# EAGLE design Scart (EAGLE 7.3.0)
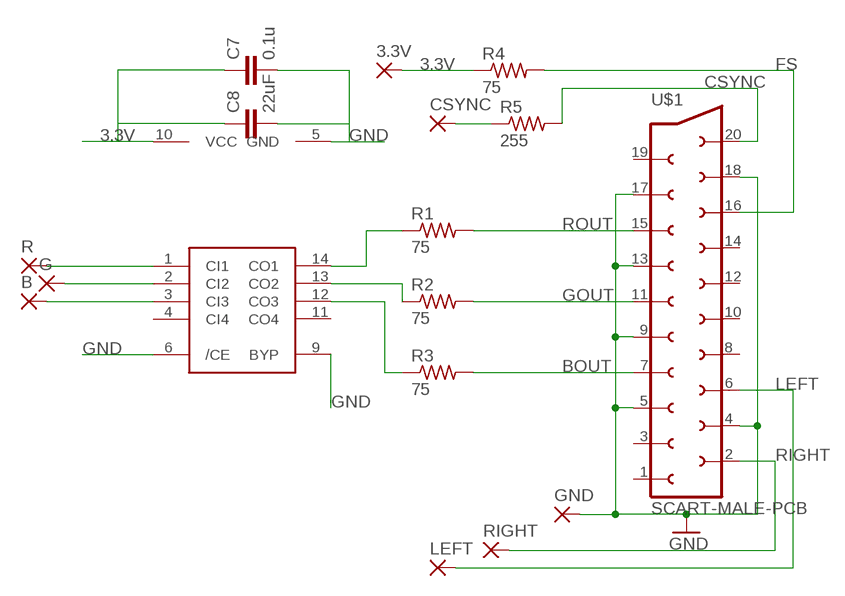
[diagram p0: schematic, sheet 1]

## Parts
3.3V  WIREPADSMD1,27-254  [SMD1,27-2,54]
B  WIREPADSMD1,27-254  [SMD1,27-2,54]
C7  0.1u  C-EUC0805K  [C0805K]
C8  22uF  C-EUC0805K  [C0805K]
CSYNC  WIREPADSMD1,27-254  [SMD1,27-2,54]
G  WIREPADSMD1,27-254  [SMD1,27-2,54]
GND  WIREPADSMD1,27-254  [SMD1,27-2,54]
LEFT  WIREPADSMD1,27-254  [SMD1,27-2,54]
R  WIREPADSMD1,27-254  [SMD1,27-2,54]
R1  75  R-US_R0805  [R0805]
R2  75  R-US_R0805  [R0805]
R3  75  R-US_R0805  [R0805]
R4  75  R-US_R0805  [R0805]
R5  255  R-US_R0805  [R0805]
RIGHT  WIREPADSMD1,27-254  [SMD1,27-2,54]
U$1  SCART-MALE-PCB  [SCART-PCB]
U$2  THS7374  [THS7374]

## Nets
3.3V: 3.3V.1(P) C7.1 C8.1 R4.1 U$2.10(VCC)
BOUT: R3.2 U$1.7
CSYNC: R5.2 U$1.20
FS: R4.2 U$1.16
GND: C7.2 C8.2 GND.1(P) U$1.4 U$1.5 U$1.9 U$1.13 U$1.17 U$1.18 U$2.5(GND) U$2.6(/CE) U$2.9(BYP)
GOUT: R2.2 U$1.11
LEFT: LEFT.1(P) U$1.6
N$4: R.1(P) U$2.1(CI1)
N$8: R1.1 U$2.14(CO1)
N$9: R2.1 U$2.13(CO2)
N$11: R3.1 U$2.12(CO3)
N$14: G.1(P) U$2.2(CI2)
N$16: B.1(P) U$2.3(CI3)
N$17: CSYNC.1(P) R5.1
RIGHT: RIGHT.1(P) U$1.2
ROUT: R1.2 U$1.15
Unconnected: U$1.1 U$1.3 U$1.8 U$1.10 U$1.12 U$1.14 U$1.19 U$2.4(CI4) U$2.11(CO4)

## Library data of the parts
3.3V B CSYNC G GND LEFT R RIGHT = wirepad:WIREPAD: Wire PAD connect wire on PCB
C7 C8 = rcl:C-EU: CAPACITOR, European symbol
R1-R5 = rcl:R-US_: RESISTOR, American symbol
U$1 = con-hirschmann:SCART-MALE-PCB
U$2 = snes_div:THS7374

## Board
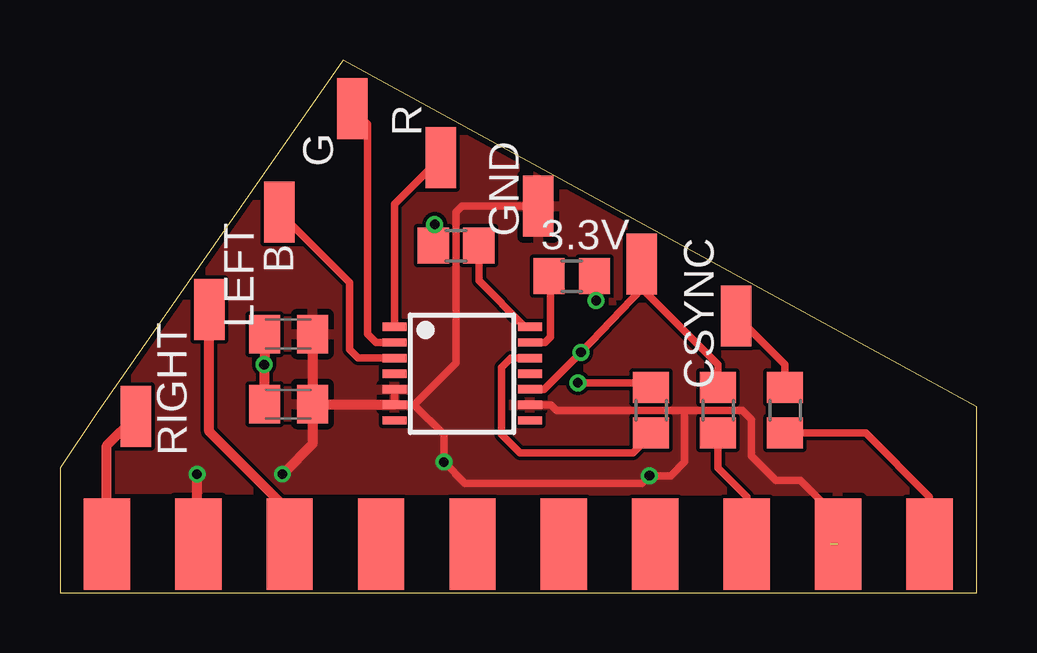
[diagram p1: board, top side]
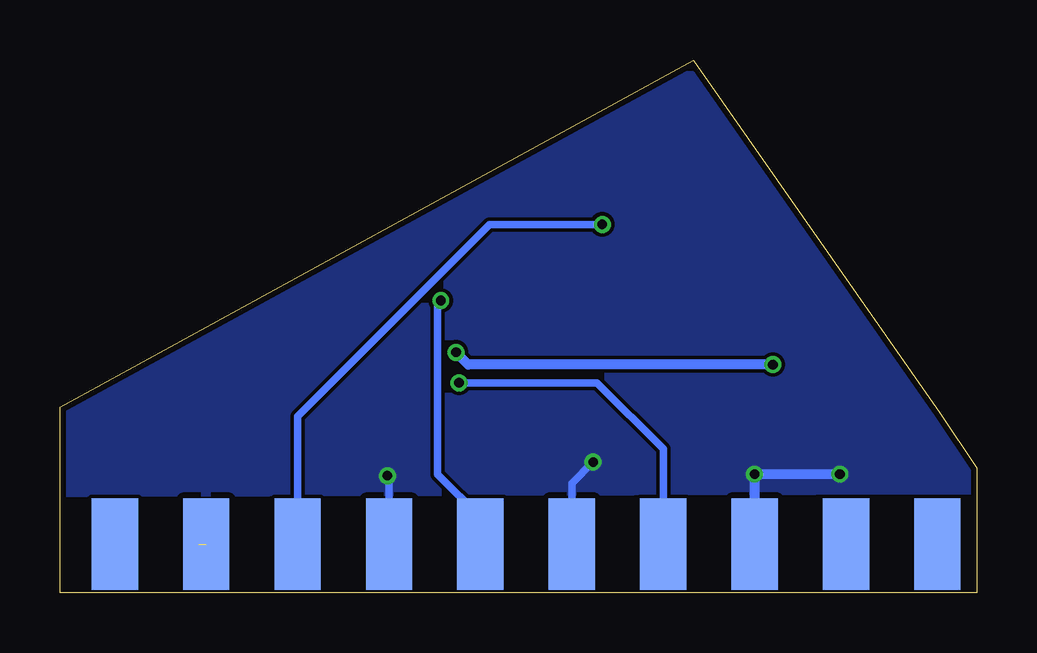
[diagram p2: board, bottom side, seen from below]

Size 38.23 x 22.23 mm. Coordinates in mm from the lower left corner, seen from the top.
Outline: 11.81,22.23 1.52,7.49 0,5.21 0,0 38.23,0 38.23,7.75 11.81,22.23
Copper layers (1*16): Top 0.035mm / dielectric 1.5mm / Bottom 0.035mm
Design rules "seedstudio_Fusion_eagle_rule_v1.1": minimum track width 6mil, minimum drill 12mil, track to track 6mil, track to pad 6mil, pad to pad 6mil, via to via 6mil, smd to smd 0mil, copper to edge 10mil, drill to drill 10mil, minimum pad ring 10mil, minimum via ring 6mil, stop-mask expansion 2mil, vias tented up to drill 100mil, thermal gap 10mil

### Footprints (pad centres in the part's own frame; a part is rotated, then mirrored left to right if it is on the bottom)
SMD1,27-2,54 = smd 1.27 x 2.54: 1 0,0
C0805K = smd 1.3 x 1.6: 1 -1,0; 2 1,0
R0805 = smd 1.3 x 1.5: 1 -0.95,0; 2 0.95,0
SCART-PCB = smd 1.93 x 3.81: 1 16.51,0; 3 12.7,0; 5 8.89,0; 7 5.08,0; 9 1.27,0; 11 -2.54,0; 13 -6.35,0; 15 -10.16,0; 17 -13.97,0; 19 -17.78,0 | smd 1.93 x 3.81 bottom: 2 16.205,0; 4 12.395,0; 6 8.585,0; 8 4.775,0; 10 0.965,0; 12 -2.845,0; 14 -6.655,0; 16 -10.465,0; 18 -14.275,0; 20 -18.085,0
THS7374 = smd 0.35 x 1: 1 -1.95,-2.825; 2 -1.3,-2.825; 3 -0.65,-2.825; 4 0,-2.825; 5 0.65,-2.825; 6 1.3,-2.825; 7 1.95,-2.825; 8 1.95,2.825; 9 1.3,2.825; 10 0.65,2.825; 11 0,2.825; 12 -0.65,2.825; 13 -1.3,2.825; 14 -1.95,2.825

### Placement (x,y rotation side)
3.3V  24.26,13.72 0 top
B  9.14,15.88 0 top
C7  9.53,10.79 0 top
C8  9.53,7.87 0 top
CSYNC  28.19,11.56 0 top
G  12.19,20.19 0 top
GND  19.94,16.13 0 top
LEFT  6.22,11.81 0 top
R  15.88,18.16 0 top
R1  16.51,14.48 180 top
R2  21.34,13.21 0 top
R3  24.64,7.62 90 top
R4  27.43,7.62 270 top
R5  30.23,7.62 270 top
RIGHT  3.18,7.37 0 top
U$1  18.16,2.03 0 bottom
U$2  16.76,9.14 270 top

### Tracks (layer width: path | path; a pad name or v marks a point on that pad's centre or on a via)
3.3V  (via drill 0.4)
  Top 0.305: 3.3V.1 24.26,12.7 | 24.26,12.7 v21.72,10.03 20.18,8.49 U$2.10 | R4.1 27.43,9.53 24.26,12.7
  Top 0.406: C7.1 8.53,9.54 v8.51,9.53 8.53,9.51 C8.1
  Bottom 0.406: v8.51,9.53 21.21,9.53 v21.72,10.03
BOUT  (via drill 0.4)
  Top 0.305: v21.59,8.76 24.45,8.76 R3.2
  Bottom 0.305: U$1.7 13.08,6 15.84,8.76 v21.59,8.76
CSYNC
  Top 0.305: U$1.20 36.25,4.01 33.59,6.67 R5.2
FS
  Top 0.305: R4.2 27.43,5.21 28.63,4.01 U$1.16
GND  (via drill 0.4)  (1 unrouted)
  Top 0.305: U$2.5 U$2.6 14.76,7.84 | v24.57,4.89 24.26,4.57 16.89,4.57 v16,5.46 16,6.6 14.76,7.84 | v24.57,4.89 24.64,4.95 | U$1.18 32.44,3.12 30.86,4.7 29.84,4.7 28.83,5.71 28.83,7.24 28.45,7.62 26.04,7.62 | 26.04,7.62 20.7,7.62 20.48,7.84 U$2.9 | v24.57,4.89 25.46,4.89 26.04,5.46 26.04,7.62 | GND.1 16.76,16.13 16.51,15.88 16.51,9.59 14.76,7.84
  Top 0.406: U$1.4 5.71,2.03 v5.71,4.95 | U$2.6 10.55,7.84 C8.2 | C7.2 C8.2 | C8.2 10.53,6.21 v9.27,4.95
  Bottom 0.305: U$1.13 24.51,4.83 v24.57,4.89 | U$1.9 16.89,4.57 v16,5.46
  Bottom 0.406: v5.71,4.95 v9.27,4.95 9.27,4.57 U$1.5
  pour Top: 11.94,22.48 44.7,4.19 -0.89,4.32
  pour Bottom: 11.94,22.48 44.7,4.19 -0.89,4.32
GOUT  (via drill 0.4)
  Top 0.305: v22.35,12.19 22.35,13.14 R2.2
  Bottom 0.305: U$1.11 20.7,3.17 22.48,4.95 22.48,12.06 v22.35,12.19
LEFT
  Top 0.406: U$1.6 9.58,3.38 6.22,6.73 LEFT.1
N$4
  Top 0.305: U$2.1 13.94,16.23 R.1
N$8
  Top 0.305: U$2.14 19.39,11.09 17.46,13.02 R1.1
N$9
  Top 0.305: U$2.13 20.22,10.44 20.45,10.67 20.45,13.15 R2.1
N$11
  Top 0.305: R3.1 24.64,6.6 23.88,5.84 19.18,5.84 18.41,6.6 18.41,9.4 18.81,9.79 U$2.12
N$14
  Top 0.305: U$2.2 13.18,10.44 12.83,10.79 12.83,19.56 G.1
N$16
  Top 0.305: U$2.3 12.43,9.79 12.07,10.16 12.07,12.95 B.1
N$17
  Top 0.305: R5.1 30.23,9.53 CSYNC.1
RIGHT
  Top 0.406: U$1.2 1.96,6.15 RIGHT.1
ROUT  (via drill 0.4)
  Top 0.305: v15.62,15.37 15.62,14.54 R1.2
  Bottom 0.305: U$1.15 28.32,7.37 20.32,15.37 v15.62,15.37

### Text on the board
201bmp: C:/Users/rodriguj/Documents/zxspectrum/zxuno/repositorio/hardware/otros/zxuno2scart/silueta.bmp